# EAGLE design SunnysideTimerV1 (EAGLE 7.7.0)
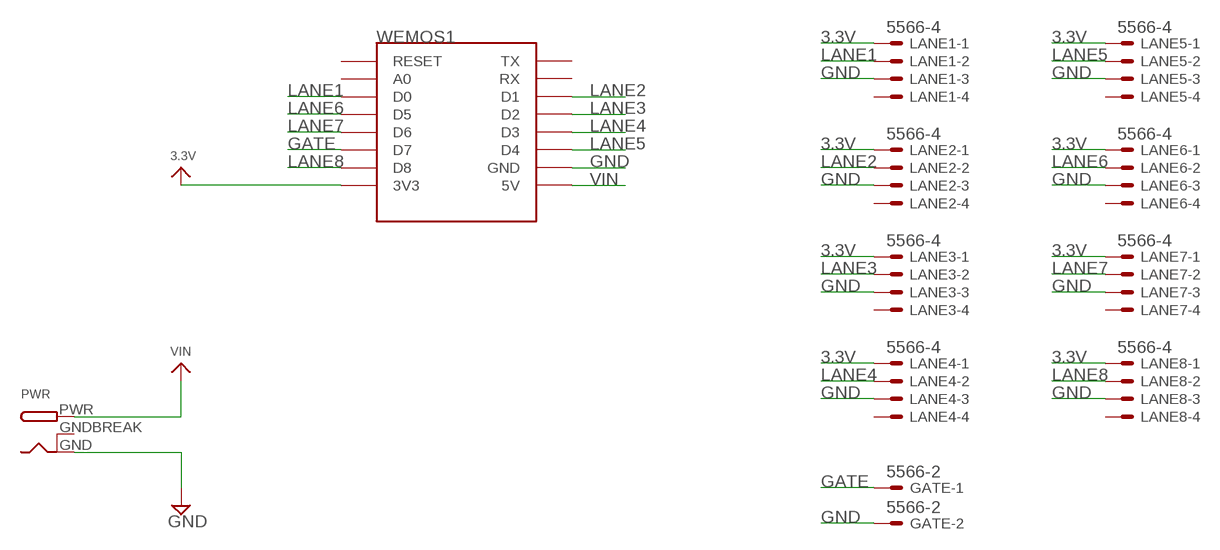
[diagram p0: schematic, sheet 1]

## Parts
GATE  5566-2  [5566-2]
LANE1  5566-4  [5566-4]
LANE2  5566-4  [5566-4]
LANE3  5566-4  [5566-4]
LANE4  5566-4  [5566-4]
LANE5  5566-4  [5566-4]
LANE6  5566-4  [5566-4]
LANE7  5566-4  [5566-4]
LANE8  5566-4  [5566-4]
PWR  DCBARRELPTH  [DCJACK_2MM_PTH]
WEMOS1  WEMOS-D1-MINI  [WEMOS-D1-MINI]

## Nets
3.3V: LANE1.1 LANE2.1 LANE3.1 LANE4.1 LANE5.1 LANE6.1 LANE7.1 LANE8.1 WEMOS1.3V3
GATE: GATE.1 WEMOS1.D7
GND: GATE.2 LANE1.3 LANE2.3 LANE3.3 LANE4.3 LANE5.3 LANE6.3 LANE7.3 LANE8.3 PWR.GND WEMOS1.GND
LANE1: LANE1.2 WEMOS1.D0
LANE2: LANE2.2 WEMOS1.D1
LANE3: LANE3.2 WEMOS1.D2
LANE4: LANE4.2 WEMOS1.D3
LANE5: LANE5.2 WEMOS1.D4
LANE6: LANE6.2 WEMOS1.D5
LANE7: LANE7.2 WEMOS1.D6
LANE8: LANE8.2 WEMOS1.D8
VIN: PWR.PWR WEMOS1.5V
Unconnected: LANE1.4 LANE2.4 LANE3.4 LANE4.4 LANE5.4 LANE6.4 LANE7.4 LANE8.4 WEMOS1.A0 WEMOS1.RESET WEMOS1.RX WEMOS1.TX

## Power pins joined to a net without a drawn wire
GNDBREAK: PWR.GNDBREAK

## Library data of the parts
GATE = con-molex:5566-2: Mini FIT connector 2 pol Source: http://www.molex.com; OC_FARNELL: 1822072; OC_NEWARK: unknown
LANE1-LANE8 = con-molex:5566-4: Mini FIT connector 4 pol Source: http://www.molex.com; OC_FARNELL: unknown; OC_NEWARK: unknown
PWR = adafruit:DCBARREL: 2.0mm DC Barrel Jack DCJACK_2MM_PTH - Through Hole Jack (4UConnector: 05537)
WEMOS1 = esp8266modules:WEMOS-D1-MINI: WeMos.cc D1 mini ESP8266 module

## Board
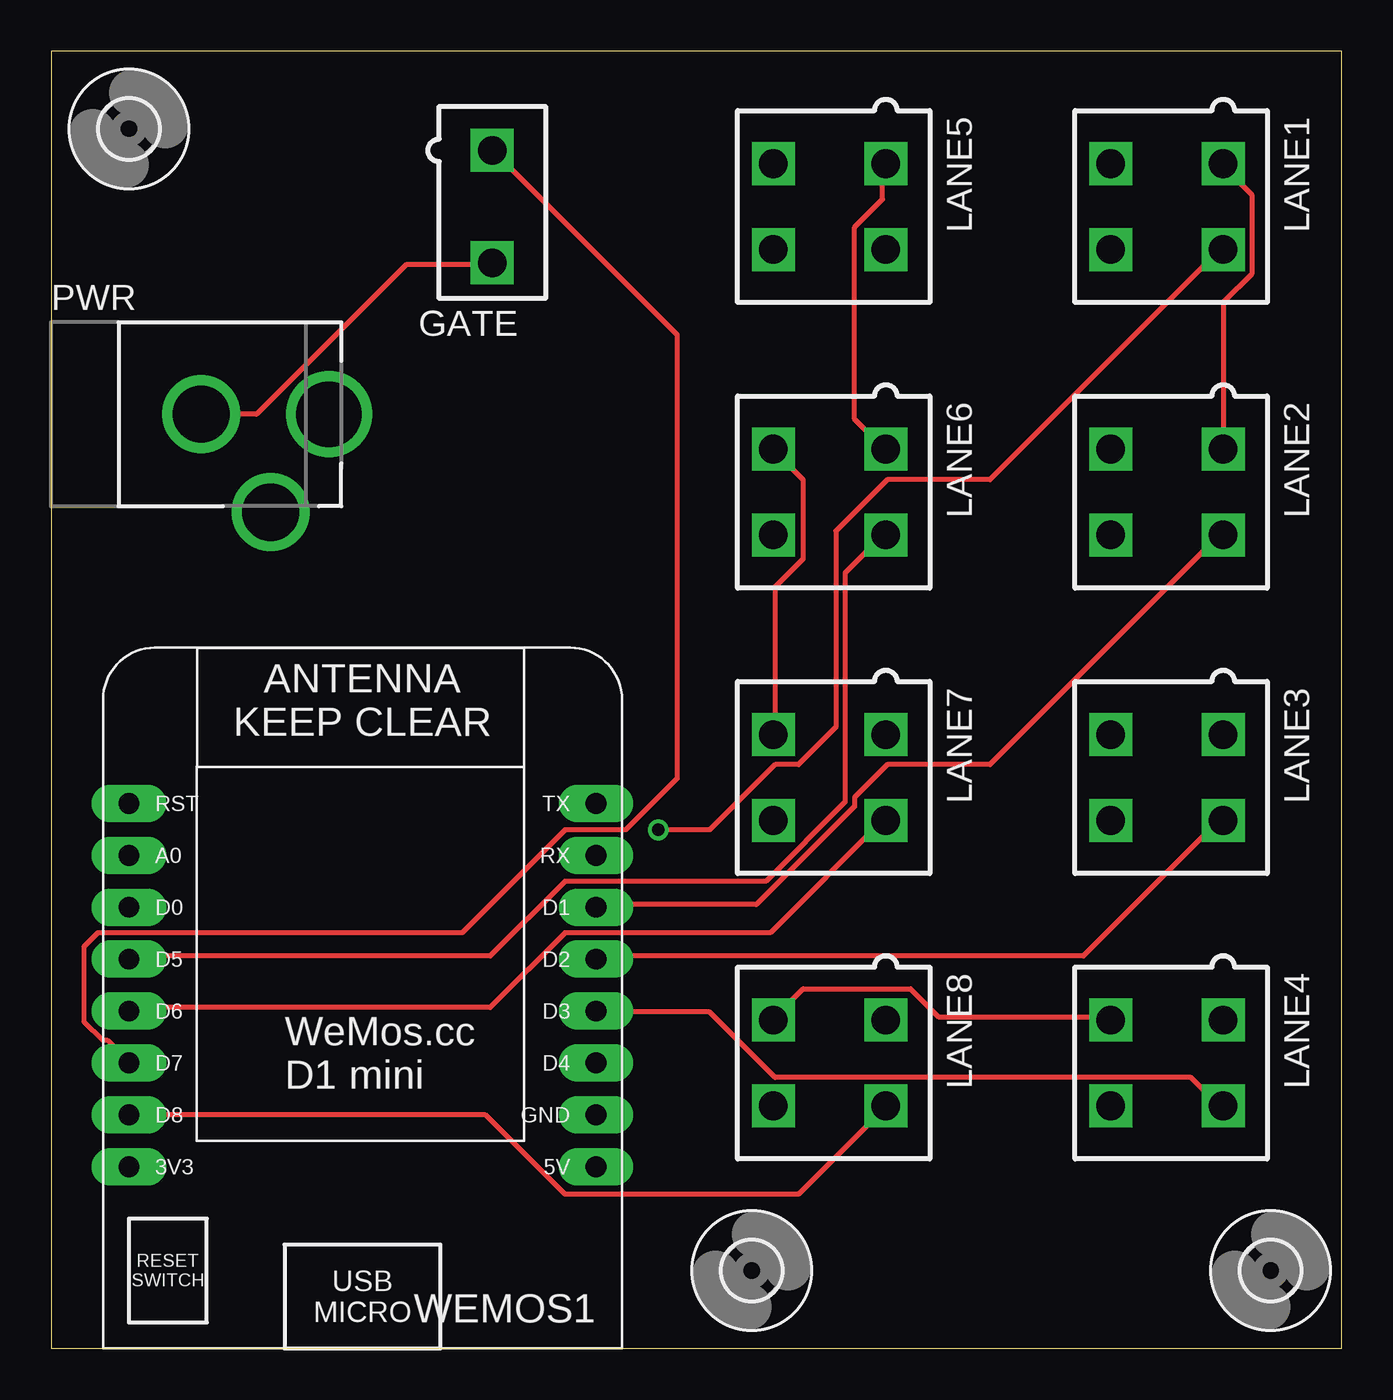
[diagram p1: board, top side]
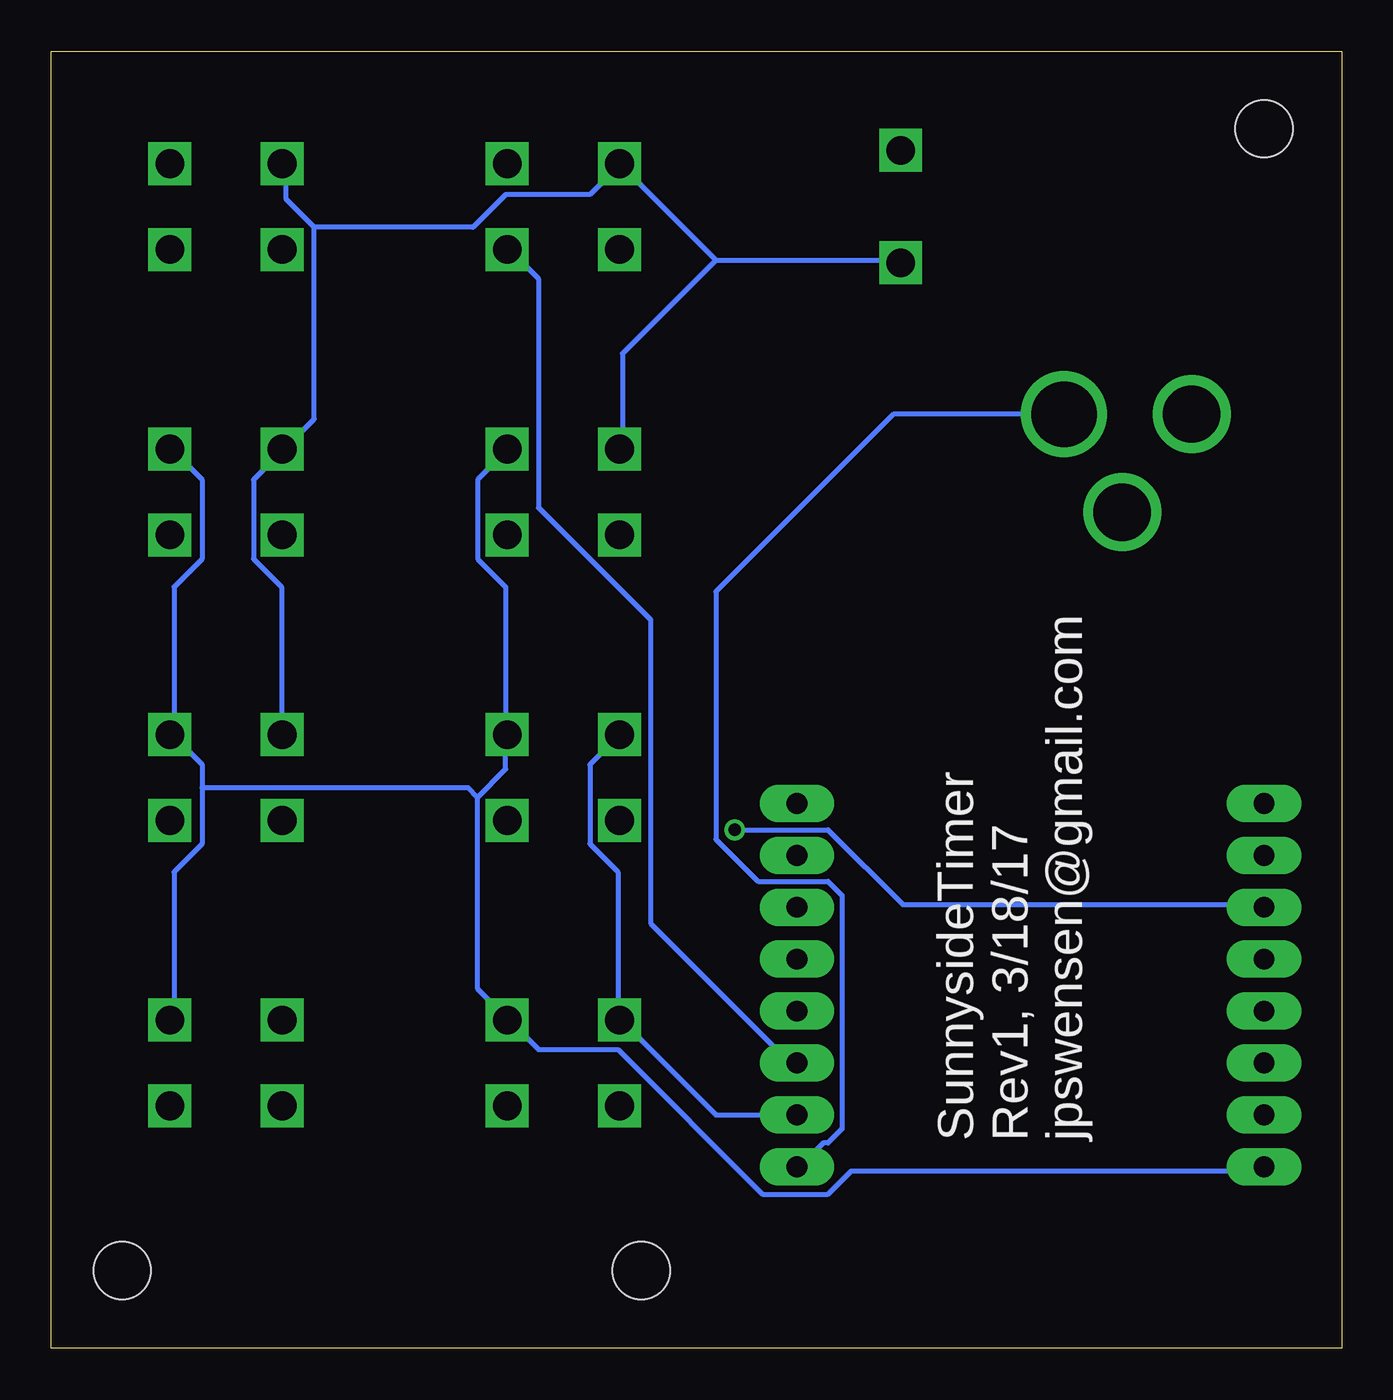
[diagram p2: board, bottom side, seen from below]

Size 63.17 x 63.49 mm. Coordinates in mm from the lower left corner, seen from the top.
Outline: 0,0 63.17,0 63.17,63.49 0,63.49 0,0
Copper layers (1*16): Top 0.035mm / dielectric 1.5mm / Bottom 0.035mm
Design rules "default": minimum track width 10mil, minimum drill 24mil, track to track 8mil, track to pad 8mil, pad to pad 8mil, via to via 8mil, smd to smd 8mil, copper to edge 40mil, drill to drill 8mil, minimum pad ring 10mil, minimum via ring 8mil, stop-mask expansion 4mil, vias tented up to drill 0mil, thermal gap 10mil
tRestrict: area 0,27.9 to 30.5,36.8
bRestrict: area 0,27.9 to 30.5,36.8
vRestrict: area 0,27.9 to 30.5,36.8

### Footprints (pad centres in the part's own frame; a part is rotated, then mirrored left to right if it is on the bottom)
5566-2 = drill 1.4 square: 1 0,-2.75; 2 0,2.75
5566-4 = drill 1.4 square: 1 2.1,-2.75; 2 -2.1,-2.75; 3 2.1,2.75; 4 -2.1,2.75
DCJACK_2MM_PTH = drill 2.8: GND 0,7.35; GNDBREAK 4.8,10.75 | drill 3.2: PWR 0,13.6
2,8 = hole 2.8: 0,0
WEMOS-D1-MINI = drill 1.016 pad 1.829 long: 3V3 -10.16,-10.16; 5V 12.7,-10.16; A0 -10.16,5.08; D0 -10.16,2.54; D1 12.7,2.54; D2 12.7,0; D3 12.7,-2.54; D4 12.7,-5.08; D5 -10.16,0; D6 -10.16,-2.54; D7 -10.16,-5.08; D8 -10.16,-7.62; GND 12.7,-7.62; RESET -10.16,7.62; RX 12.7,5.08; TX 12.7,7.62

### Placement (x,y rotation side)
GATE  21.59,55.88 180 top
LANE1  54.61,55.88 90 top
LANE2  54.61,41.91 90 top
LANE3  54.61,27.94 90 top
LANE4  54.61,13.97 90 top
LANE5  38.1,55.88 90 top
LANE6  38.1,41.91 90 top
LANE7  38.1,27.94 90 top
LANE8  38.1,13.97 90 top
PWR  0,45.72 270 top
U$3  [2,8]  59.69,3.81 0 top
U$4  [2,8]  3.81,59.69 0 top
U$5  [2,8]  34.29,3.81 0 top
WEMOS1  13.97,19.05 0 top

### Tracks (layer width: path | path; a pad name or v marks a point on that pad's centre or on a via)
3.3V
  Top 0.254: LANE2.1 57.38,44.12 57.38,51.21 58.75,52.58 58.75,56.46 57.38,57.84 LANE1.1 | LANE5.1 40.69,57.84 40.69,56.24 39.32,54.86 39.32,45.49 40.69,44.12 LANE6.1
  Bottom 0.254: 55.78,27.43 55.78,28.57 57.15,29.95 LANE3.1 57.15,30.18 57.15,37.26 55.78,38.63 55.78,42.52 57.15,43.89 LANE2.1 | 55.78,27.43 55.78,24.69 57.15,23.32 57.15,16.23 LANE4.1 | LANE6.1 40.92,43.89 42.29,42.52 42.29,38.63 40.92,37.26 40.92,30.18 LANE7.1 40.92,29.95 40.92,28.35 42.29,26.98 | WEMOS1.3V3 3.89,8.69 24,8.69 25.15,7.54 28.35,7.54 35.43,14.63 39.32,14.63 40.69,16 LANE8.1 40.92,16.23 42.29,17.6 42.29,26.98 | 55.78,27.43 42.75,27.43 42.29,26.98
GATE
  Top 0.254: WEMOS1.D7 3.66,14.17 2.74,15.09 2.52,15.09 1.6,16 1.6,19.66 2.29,20.34 20.12,20.34 25.15,25.38 28.12,25.38 30.63,27.89 30.63,49.61 21.72,58.52 GATE.1
GND
  Top 0.254: LANE4.3 51.66,16.23 43.43,16.23 42.06,17.6 36.8,17.6 35.43,16.23 LANE8.3 | LANE7.3 35.43,30.18 35.43,37.26 36.8,38.63 36.8,42.52 35.43,43.89 LANE6.3 | PWR.GND 10.06,45.72 17.37,53.03 21.49,53.03 GATE.2
  Bottom 0.254: WEMOS1.GND 30.63,11.43 35.2,16 LANE8.3 35.43,16.23 35.43,23.32 36.8,24.69 36.8,28.57 35.43,29.95 LANE7.3 | LANE3.3 51.89,30.18 51.89,37.26 53.26,38.63 53.26,42.52 51.89,43.89 LANE2.3 51.66,44.12 50.29,45.49 50.29,54.86 | 50.29,54.86 51.66,56.24 51.66,57.84 LANE1.3 | 30.63,53.26 21.72,53.26 GATE.2 | 30.63,53.26 35.2,57.84 LANE5.3 35.43,57.84 36.8,56.46 40.92,56.46 42.52,54.86 50.29,54.86 | 30.63,53.26 35.2,48.69 35.2,44.12 LANE6.3
LANE1  (via drill 0.61)
  Top 0.254: v29.72,25.38 32.23,25.38 35.43,28.57 36.58,28.57 38.41,30.4 38.41,40.01 40.92,42.52 45.95,42.52 57.15,53.72 LANE1.2
  Bottom 0.254: v29.72,25.38 25.15,25.38 21.49,21.72 3.89,21.72 WEMOS1.D0
LANE2
  Top 0.254: WEMOS1.D1 26.75,21.72 34.52,21.72 39.32,26.52 39.32,26.98 40.92,28.57 45.95,28.57 57.15,39.78 LANE2.2
LANE3
  Top 0.254: WEMOS1.D2 26.75,19.2 50.52,19.2 57.15,25.83 LANE3.2
LANE4
  Top 0.254: WEMOS1.D3 26.75,16.46 32.23,16.46 35.43,13.26 55.78,13.26 57.15,11.89 LANE4.2
LANE5
  Bottom 0.254: WEMOS1.D4 26.75,14.17 27.2,14.17 33.83,20.8 33.83,35.66 39.32,41.15 39.32,52.35 40.69,53.72 LANE5.2
LANE6
  Top 0.254: WEMOS1.D5 3.89,19.2 21.49,19.2 25.15,22.86 34.98,22.86 38.86,26.75 38.86,37.95 40.69,39.78 LANE6.2
LANE7
  Top 0.254: WEMOS1.D6 3.89,16.69 21.49,16.69 25.15,20.34 35.2,20.34 40.69,25.83 LANE7.2
LANE8
  Top 0.254: WEMOS1.D8 21.26,11.43 25.15,7.54 36.58,7.54 40.69,11.66 LANE8.2
VIN
  Bottom 0.254: PWR.PWR 21.95,45.72 30.63,37.03 30.63,24.92 28.57,22.86 25.15,22.86 24.46,22.17 24.46,10.74 25.15,10.06 25.38,10.06 26.52,8.91 WEMOS1.5V

### Text on the board
_bsilk: SunnysideTimer / Rev1, 3/18/17 / jpswensen@gmail.com